# Altium schematic sheet JHDrivesheet1.SchDoc
size A4; SheetNumber: 1; SheetTotal: 2
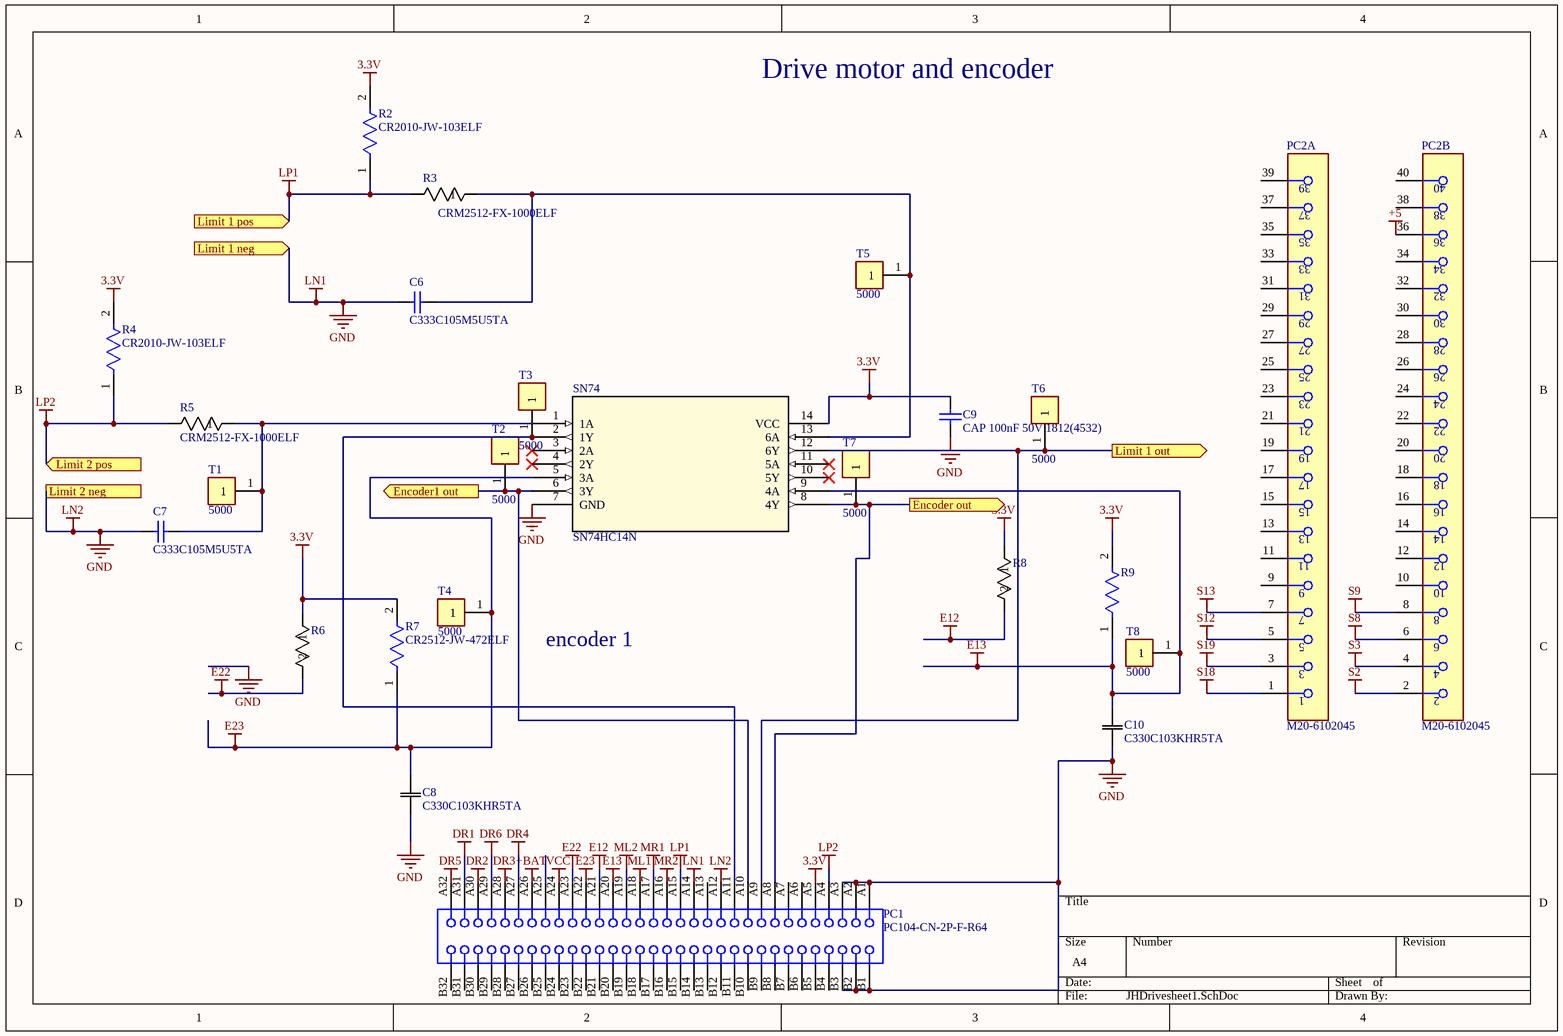
[diagram p0: JHDrivesheet1.SchDoc]

## Parts
C6  C333C105M5U5TA  [KEMT-C333C105M5U5TA-2]
C7  C333C105M5U5TA  [KEMT-C333C105M5U5TA-2]
C8  C330C103KHR5TA  [CAP_C330C_MR_COG_KEM]
C9  CAP 100nF 50V 1812(4532)  [CAPC1812(4532)100_M]
C10  C330C103KHR5TA  [CAP_C330C_MR_COG_KEM]
PC1  PC104-CN-2P-F-R64  [BTB2-54-V64F-04]
PC2  M20-6102045  [FP-M20-6102045-MFG]  (parts A,B of 2)
R2  CR2010-JW-103ELF  [FP-CR2010-IPC_C]
R3  CRM2512-FX-1000ELF  [BO_CR2512]
R4  CR2010-JW-103ELF  [FP-CR2010-IPC_C]
R5  CRM2512-FX-1000ELF  [BO_CR2512]
R6  CRM2512-FX-1000ELF  [BO_CR2512]  (value not drawn)
R7  CR2512-JW-472ELF  [FP-CR2512-IPC_A]
R8  CRM2512-FX-1000ELF  [BO_CR2512]  (value not drawn)
R9  CR2512-JW-472ELF  [FP-CR2512-IPC_A]  (value not drawn)
SN74  SN74HC14N  [N14]
T1  5000  [FP-5000-MFG]
T2  5000  [FP-5000-MFG]
T3  5000  [FP-5000-MFG]
T4  5000  [FP-5000-MFG]
T5  5000  [FP-5000-MFG]
T6  5000  [FP-5000-MFG]
T7  5000  [FP-5000-MFG]
T8  5000  [FP-5000-MFG]

## Ports
Encoder1 out (out), Encoder out (out), Limit 1 neg (in), Limit 1 out (out), Limit 1 pos (in), Limit 2 neg, Limit 2 pos (in)

## Nets
3.3V: C9.2 PC1.A5 R2.2 R4.2 R6.1 R7.2 R8.1 R9.2 SN74.14(VCC)
+5: PC2.36
+BAT: PC1.A26
DR1: PC1.A31
DR2: PC1.A30
DR3: PC1.A28
DR4: PC1.A27
DR5: PC1.A32
DR6: PC1.A29
E12: PC1.A21 R8.2
E13: C10.2 PC1.A20 R9.1 SN74.9(4A) T8.1
E22: PC1.A23 R6.2
E23: C8.2 PC1.A22 R7.1 SN74.5(3A) T4.1
GND: C6.1 C7.1 C8.1 C9.1 C10.1 PC1.A1 PC1.A2 PC1.A3 PC1.A12 PC1.A14 PC1.B1 PC1.B2 PC1.B3 SN74.7(GND) ; port Limit 1 neg, port Limit 2 neg  [also labelled LN1, LN2]
LP1: PC1.A15 R2.1 R3.2 ; port Limit 1 pos
LP2: PC1.A4 R4.1 R5.2 ; port Limit 2 pos
ML1: PC1.A18
ML2: PC1.A19
MR1: PC1.A17
MR2: PC1.A16
S2: PC2.2
S3: PC2.4
S8: PC2.6
S9: PC2.8
S12: PC2.5
S13: PC2.7
S18: PC2.1
S19: PC2.3
VCC: PC1.A24
Encoder1 out: PC1.A10 SN74.6(3Y) T2.1 ; port Encoder1 out
Encoder out: PC1.A8 SN74.8(4Y) T7.1 ; port Encoder out
Limit 1 out: PC1.A9 SN74.12(6Y) T6.1 ; port Limit 1 out
NetC6_2: C6.2 R3.1 SN74.13(6A) T5.1
NetC7_2: C7.2 R5.1 SN74.1(1A) T1.1
NetPC1_A11: PC1.A11 SN74.2(1Y) T3.1

Not connected (* = marked no-connect by the designer): PC1 A6(6) A7(7) A13(13) A25(25) B4(36) B5(37) B6(38) B7(39) B8(40) B9(41) B10(42) B11(43) B12(44) B13(45) B14(46) B15(47) B16(48) B17(49) B18(50) B19(51) B20(52) B21(53) B22(54) B23(55) B24(56) B25(57) B26(58) B27(59) B28(60) B29(61) B30(62) B31(63) B32(64); PC2 9 10 11 12 13 14 15 16 17 18 19 20 21 22 23 24 25 26 27 28 29 30 31 32 33 34 35 37 38 39 40; SN74 3(2A)* 4(2Y)* 10(5Y)* 11(5A)*

## Notes on the sheet
- Drive motor and encoder
- encoder 1

## Library data of the parts
C6 C7 = CMP-2000-05174-1: Multilayer Ceramic Capacitor / Axial and Radial Leaded, 1 uF, +/- 20%, 10 to 85 degC, 2-Pin THD, RoHS, Bulk; Manufacturer: Kemet; Voltage Rating: 50V; Temperature Coefficient / Code: Z5U; Case Height: 3.81mm; Lead Diameter: 0.51mm; Case Style: ConformallyCoated; Dissipation Factor DF: 4; Capacitance: 1uF; Case Length: 9.91mm; Type: RadialLeads; Case Width: 7.62mm; Dimensions: 7.62mmWx9.91mmLx3.81mmH; Termination Style: Radial; Factory Pack Quantity: 250; Packaging: Bulk; RoHS: Details; Datasheet Version: Jul-09; Lead Spacing: 5.08mm; Product Category: MultilayerCeramicCapacitorsMLCC-Leaded; Maximum Operating Temperature: +125C; Product: GeneralTypeMLCCs; Manufacturer URL: http://www.kemet.com/; Lead Style: InsideBend; Operating Temperature Range: -55Cto+125C; Datasheet URL: http://www.farnell.com/datasheets/706880.pdf; Voltage Rating DC: 50V; Brand: Kemet; Series: C333; Tolerance: 20%; Minimum Operating Temperature: -55C
C8 C10 = C330C103KHR5TA: No Description Available; Mfr_Name: Kemet; Type: DEV; Copyright: Copyright (C) 2023 Ultra Librarian. All rights reserved.; Manufacturer_Part_Number: C330C103KHR5TA; RefDes: RefDes
C9 = CMP-1040-01293-1: CAP 100nF 50V ±20% 1812 (4532 Metric) Thickness 1mm SMD; Case-Metric: 4532; Tolerance: Â±20%; Case-EIA: 1812; Rated Voltage: 50 V; Value: 100nF; Max Thickness: 1 mm; Technology: SMT
PC1 = CMP-0001-00110-1: Board-to-Board Connector, PC104 BA ISA, Stackthrough, Vertical, 2-Row, 64-Postion, Pitch 2.54mm,  Receptacle, Height 11.05mm; Mating Connector: Harwin-M20-6103205 (stackthrough); Publisher: Altium; ClassName: Board Template Connector; Component Kind: Standard; Package Reference: BTB2-54-V64F-04
PC2 = CMP-15831-000080-1: CONN STKTHRU PC/104 40POS PCB; Current Rating: 3A; Pitch: 2.54mm; Insulation Resistance: 5GR; Contact Resistance: 30mR; Number of Positions: 40; Gender: Receptacle; REACH SVHC: No SVHC; Housing Material: Nylon; Number of Rows: 2; Min Operating Temperature: -55°C; Contact Plating: Gold; Orientation: Straight; Mount: Through Hole; Contact Material: Bronze; Length: 51.46mm; Weight: 0.218205oz; Number of Contacts: 40; Packaging: Rail/Tube; Depth: 5.25mm; Termination: Solder; Radiation Hardening: No; Flammability Rating: UL94 V-0; Housing Color: Black; Max Operating Temperature: 105°C; Material: Nylon; Package Quantity: 11; Color: Black; Max Current Rating: 3A; Series: M20
R2 R4 = CMP-07231-003456-1: Thick Film Chip Resistors 2010 10kΩ 0.5W 5% 200ppm/°C; Resistance: 10kR; Voltage Rating: 200V; Power Rating: 500mW; Tolerance: 5%; Contact Plating: Tin; Length: 5mm; Case/Package: 2010; Package Quantity: 4000; Max Operating Temperature: 155°C; Case Code (Imperial): 2010; Mount: Surface Mount; Case Code (Metric): 5025; Width: 2.5mm; Temperature Coefficient: 200ppm/°C; Packaging: Tape and Reel; Height: 0.6mm; Radiation Hardening: No; Composition: Thick Film; Min Operating Temperature: -55°C; Termination: SMD/SMT
R3 R5 R6 R8 = CRM2512-FX-1000ELF: No Description Available; Mfr_Name: Bourns Electronics; Copyright: Copyright (C) 2023 Ultra Librarian. All rights reserved.; Manufacturer_Part_Number: CRM2512-FX-1000ELF; RefDes: RefDes; Type: DEV
R7 R9 = CMP-1018-00090-2: Thick Film Chip Resistors 2512 4.7kΩ 1W 5% 200ppm/°C; Resistance: 4.7kR; Voltage Rating: 200V; RoHS Compliant: Yes; Max Power Dissipation: 1W; Number of Terminations: 2; Length: 0.248inch; Termination: SMD/SMT; Case/Package: 2512; Max Operating Temperature: 155°C; Series: CR2512; Package Quantity: 4000; Tolerance: 5%; Power Rating: 1W; Case Code (Metric): 6332; Temperature Coefficient: 200ppm/°C; Height: 0.03inch; Case Code (Imperial): 2512; Width: 0.122inch; Packaging: Tape and Reel; Resistor Type: Thick Film; Mount: Surface Mount; Min Operating Temperature: -55°C
SN74 = SN74HC14N: No Description Available; Mfr_Name: Texas Instruments; Copyright: Copyright (C) 2023 Ultra Librarian. All rights reserved.; Manufacturer_Part_Number: SN74HC14N; RefDes: RefDes; Type: DEV
T1-T8 = CMP-19636-000027-1: PC TEST POINT MINIATURE RED; Outside Diameter: 2.54mm; Body Material: Bronze; Number of Contacts: 1; Insulation: Insulated; Inside Diameter: 1.27mm; Hole Diameter: 1.6mm; Plating: Silver; Material: Nylon; Length: 7.62mm; Package Quantity: 100; Number of Ports: 1; Contact Material: Bronze; Orientation: Straight; RoHS Compliant: Yes; Housing Color: Red; Height: 0.3inch; Series: THM; Lead Free: Lead Free; Color: Red; Contact Plating: Tin; Mount: PCB; Packaging: Bulk; REACH SVHC: No SVHC; Flammability Rating: UL94 V-0